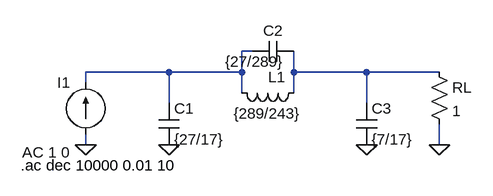
[diagram p0: schematic ej2.asc]
ej2.asc, the LTspice schematic file:
Version 4
SHEET 1 880 680
WIRE 176 48 160 48
WIRE 48 80 -80 80
WIRE 160 80 160 48
WIRE 160 80 48 80
WIRE 240 80 240 48
WIRE 352 80 240 80
WIRE 464 80 352 80
WIRE -80 96 -80 80
WIRE 160 112 160 80
WIRE 240 112 240 80
WIRE 48 128 48 80
WIRE 352 128 352 80
WIRE -80 192 -80 176
WIRE 464 192 464 160
FLAG 48 192 0
FLAG 352 192 0
FLAG 464 192 0
FLAG -80 192 0
SYMBOL cap 32 128 R0
SYMATTR InstName C1
SYMATTR Value {27/17}
SYMBOL cap 240 32 R90
WINDOW 0 0 32 VBottom 2
WINDOW 3 16 60 VTop 2
SYMATTR InstName C2
SYMATTR Value {27/289}
SYMBOL cap 336 128 R0
SYMATTR InstName C3
SYMATTR Value {7/17}
SYMBOL res 448 64 R0
SYMATTR InstName RL
SYMATTR Value 1
SYMBOL current -80 176 R180
WINDOW 0 24 80 Left 2
WINDOW 3 24 0 Left 2
WINDOW 123 24 -28 Left 2
WINDOW 39 0 0 Left 0
SYMATTR InstName I1
SYMATTR Value ""
SYMATTR Value2 AC 1 0
SYMBOL ind 256 96 R90
WINDOW 0 7 42 VBottom 2
WINDOW 3 32 56 VTop 2
SYMATTR InstName L1
SYMATTR Value {289/243}
TEXT -180 224 Left 2 !.ac dec 10000 0.01 10

The netlist it stands for:
* ej2.asc
C1 N001 0 {27/17}
C2 N002 N001 {27/289}
C3 N002 0 {7/17}
RL N002 0 1
I1 0 N001 AC 1 0
L1 N002 N001 {289/243}
.ac dec 10000 0.01 10
.backanno
.end